# Altium schematic sheet heater-control-comparator.SchDoc: Heater Control
size A; DrawnBy: B. Almeida, D. Vogel; Organization: UTAT SS; Revision: 1.0
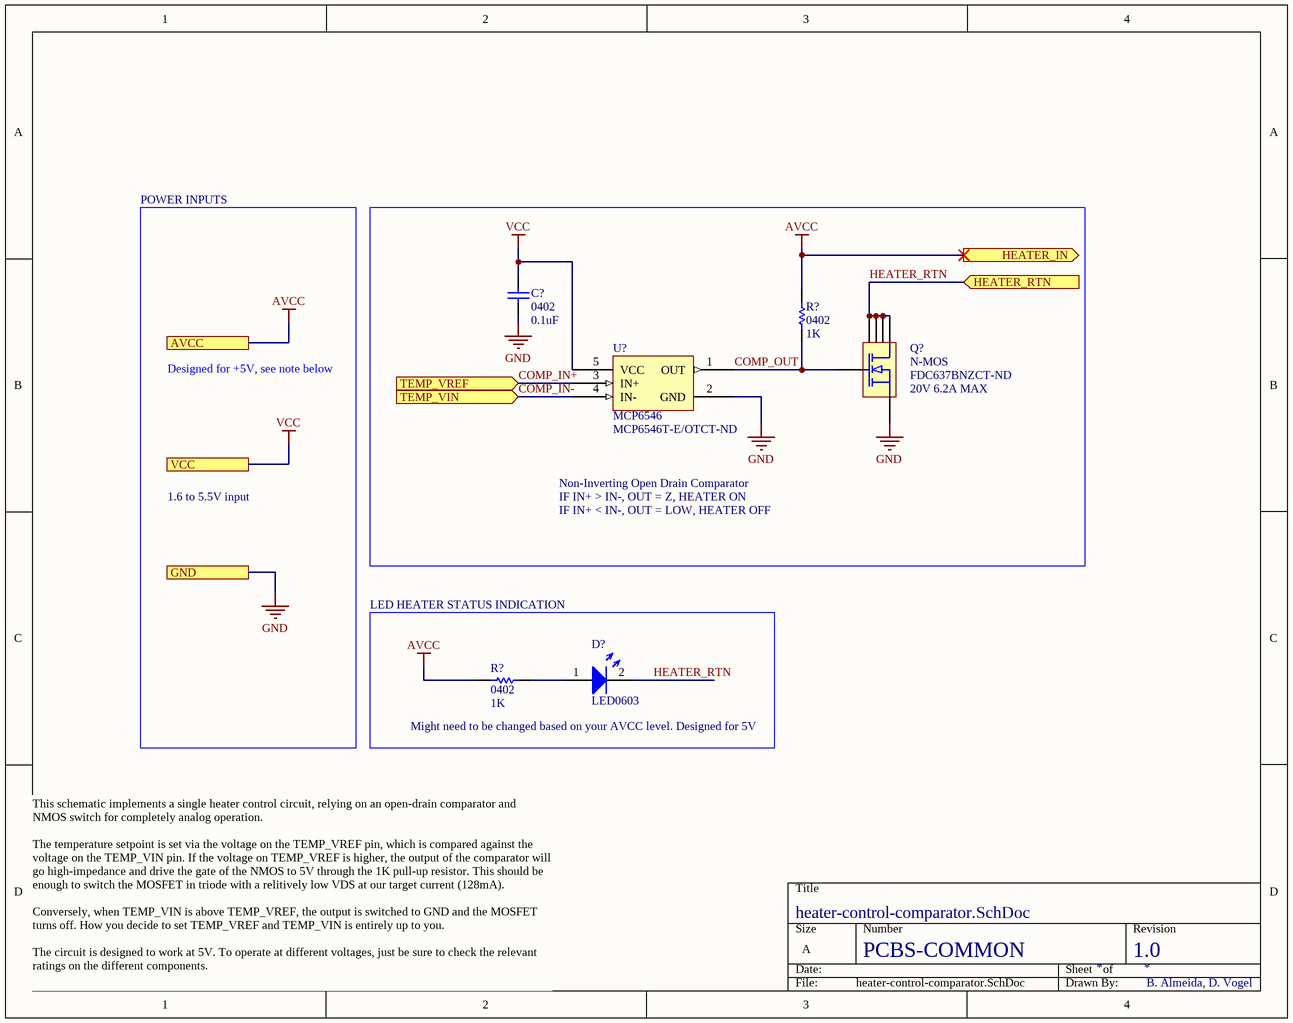
[diagram p0: heater-control-comparator.SchDoc]

## Parts
(Parts that share a designator on the sheet are numbered #1, #2 ... from top to bottom, then left to right.)
C?  0402  value 0.1uF  [CAP0402R]
D?  LED0603  [LED0603]
Q?  N-MOS  [SOT95P280X145-6N]
R?#1  0402  value 1K  [RES0402R]
R?#2  0402  value 1K  [RES0402R]
U?  MCP6546  Supplier Part Number 1: MCP6546T-E/OTCT-ND  [SOT95P290X160-5N]

## Blocks framed on the sheet
LED HEATER STATUS INDICATION: D? R?#2

## Ports
AVCC, GND, HEATER_IN (out), HEATER_RTN (in), TEMP_VIN (in), TEMP_VREF (in), VCC

## Nets
AVCC: R?#1.2 R?#2.1 ; port AVCC, port HEATER_IN
GND: C?.1 Q?.4(S) U?.2(GND) ; port GND
VCC: C?.2 U?.5(VCC) ; port VCC
COMP_IN+: U?.3(IN+) ; port TEMP_VREF
COMP_IN-: U?.4(IN-) ; port TEMP_VIN
COMP_OUT: Q?.3(G) R?#1.1 U?.1(OUT)
HEATER_RTN: D?.2 Q?.1(D) Q?.2(D) Q?.5(D) Q?.6(D) ; port HEATER_RTN
NetD?_1: D?.1 R?#2.2

## Notes on the sheet
- POWER INPUTS
- Designed for +5V, see note below
- (near Q?) 20V 6.2A MAX
- 1.6 to 5.5V input
- Non-Inverting Open Drain Comparator
- IF IN+ > IN-, OUT = Z, HEATER ON
- IF IN+ < IN-, OUT = LOW, HEATER OFF
- Might need to be changed based on your AVCC level. Designed for 5V
- PCBS-COMMON
- This schematic implements a single heater control circuit, relying on an open-drain comparator and NMOS switch for completely analog operation.
  The temperature setpoint is set via the voltage on the TEMP_VREF pin, which is compared against the voltage on the TEMP_VIN pin. If the voltage on TEMP_VREF is higher, the output of the comparator will go high-impedance and drive the gate of the NMOS to 5V through the 1K pull-up resistor. This should be enough to switch the MOSFET in triode with a relitively low VDS at our target current (128mA).
  Conversely, when TEMP_VIN is above TEMP_VREF, the output is switched to GND and the MOSFET turns off. How you decide to set TEMP_VREF and TEMP_VIN is entirely up to you.
  The circuit is designed to work at 5V. To operate at different voltages, just be sure to check the relevant ratings on the different components.

## Library data of the parts
C? = CAP0402: 0402 capacitor; Manufacturer: Taiyo Yuden; Manufacturer Part Number: EMK105B7104KVHF; Voltage Rating: 16V; Capacitance: 100nF; Tolerance: 10%; Dielectric: X7R; Supplier 1: Digi-Key; Supplier Part Number 1: 587-3807-1-ND; Stock 1: 18196; Pricing 1: 1=0.1, 10=0.057, 100=0.0254, 500=0.01812, 1000=0.01423, 2500=0.01294, 5000=0.0119 (USD); Mount: Surface Mount; Case/Package: 0402; Weight: 2.3E-05oz; Case Code (Metric): 1005; Case Code (Imperial): 0402; Min Operating Temperature: -55°C; Max Operating Temperature: 125°C; Package Quantity: 10000; Packaging: Tape and Reel; Termination: SMD/SMT; Voltage Rating (DC): 16V; Length: 0.039inch; Height: 0.5mm; Width: 0.02inch; Thickness: 0.022inch; Ratings: AEC-Q200; Lead Free: Lead Free; Halogen Free: Halogen Free
D? = LED0603: Generic 0603 LED. Use ChipLED from Osram for generic ones.
Q? = FDC637BNZCT-ND: 20V 6.2A, N-MOS, low gate on voltage; Supplier 1: Digi-Key; Supplier Part Number 1: FDC637BNZCT-ND
R?#1 R?#2 = RES0402: 0402 resistor; Manufacturer: Panasonic; Manufacturer Part Number: ERJ-PA2J102X; Resistance: 1kR; Tolerance: 5%; Max Power Dissipation: 200mW; Temperature Coefficient: 200ppm/°C; Supplier 1: Digi-Key; Supplier Part Number 1: P17193CT-ND; Stock 1: 7229; Pricing 1: 1=0.16, 10=0.133, 100=0.0518, 1000=0.0217, 2500=0.0199, 5000=0.01809 (USD); Case/Package: 0402; Case Code (Metric): 1005; Case Code (Imperial): 0402; Min Operating Temperature: -55°C; Max Operating Temperature: 155°C; Packaging: Tape and Reel; Composition: Thick Film; Number of Terminations: 2; Features: Automotive AEC-Q200; Length: 0.039inch; Height: 0.016inch; Width: 0.02inch
U? = MCP6546: Open-drain output sub-microamp comparator.; Supplier 1: Digi-Key